# Altium schematic sheet Sheet1.SchDoc
size A4; SheetNumber: 1; SheetTotal: 1; SPICEModelCacheRXAKOMBT: <root> / <DocumentId>RXAKOMBT</DocumentId> / </root>
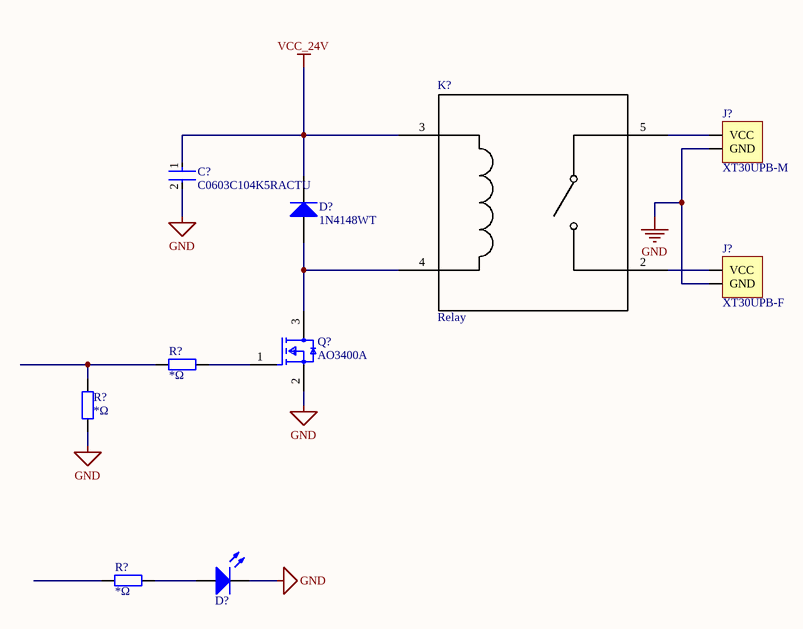
[diagram p0: Sheet1.SchDoc]

## Parts
(Parts that share a designator on the sheet are numbered #1, #2 ... from top to bottom, then left to right.)
C?  C0603C104K5RACTU  [FP-C0603C-CF-MFG]
D?#1  1N4148WT  [FAIR-SOD-523F-2_V]
D?#2  LED  [LED_0603_B]  (value not drawn)
J?#1  XT30UPB-M  [XT30UPB-M]
J?#2  XT30UPB-F  [XT30UPB-F]
K?  Relay  [RELAY-TH_HF105F-XXX-1HXXX-XXX]
Q?  AO3400A  [FP-SOT23-MFG]
R?#1  *Ω  [0603_R]
R?#2  *Ω  [0603_R]
R?#3  *Ω  [0603_R]

## Nets
GND: C?.2 D?#2.2(K) J?#1.2(GND) J?#2.2(GND) Q?.2(S) R?#2.1
VCC_24V: C?.1 D?#1.1(K) K?.3
NetD?#1_2: D?#1.2(A) K?.4 Q?.3(D)
NetD?#2_1: D?#2.1(A) R?#3.2
NetJ?#1_1: J?#1.1(VCC) K?.5
NetJ?#2_1: J?#2.1(VCC) K?.2
NetQ?_1: Q?.1(G) R?#1.2
NetR?#1_1: R?#1.1 R?#2.2

Not connected (* = marked no-connect by the designer): R?#3 1

## Library data of the parts
C? = CMP-2006-03061-2: CAP CER 0.1UF 50V X7R 0603; Manufacturer: KEMET; Tolerance: 0.1; Temperature Coefficient: 30ppm/°C; Material: Ceramic; Automotive Grade: Grade 1; Value: 0.10 μF; Temperature: -55°C to +125°C; RoHS: TRUE; Temperature Range High: +125°C; Lead Free: Yes; Octopart: https://octopart.com/c0603c104k5ractu-kemet-139244; Digikey Description: CAP CER 0.1UF 50V X7R 0603; Category: Cap; Package: C0603C-CF; ComponentLink2Description: Datasheet; Temperature Range Low: -55°C; Device Class L1: Passive Components; Voltage Rating: 50 V; Automotive: Yes; Device Class L3: Ceramic Capacitors; ComponentLink2URL: https://api.kemet.com/component-edge/download/datasheet/C0603C100J5GACAUTO.pdf; Capacitance: 0.10 μF; Device Class L2: Capacitors; Manufacturer Part Number: C0603C104K5RACTU; Temperature Characteristic: X7R; Height: 0.87mm
D?#1 = CMP-0881-00001-1: High Conductance Fast Switching Diode, 75 V, -55 to 150 degC, 2-Pin SOD523F, RoHS; Manufacturer: Fairchild Semiconductor; IR (VR: 75 V)=5 uA Max.; VF: 1 V Max.; BVR (IR: 5 uA)=75 V Min.; CO: 4 pF Max.; DatasheetVersion: Rev. A2; ComponentLink1Description: Manufacturer URL; PackageDescription: 2-Pin Surface Mount Device, Body 1.2 x 0.8 mm, Height 0.7 mm; ComponentLink2URL: http://www.fairchildsemi.com/ds/1N/1N4148WT.pdf; ComponentLink2Description: Datasheet; PartNumber: 1N4148WT; ComponentLink1URL: http://www.fairchildsemi.com/; Temperature Range: -55 to 150 degC; Mounting Technology: Surface Mount; PackageReference: SOD-523F-2; RoHS: TRUE
D?#2 = LED: Value: 0603-RED; Published: 8-Jun-2000; LatestRevisionDate: 08-Jul-2005; LatestRevisionNote: Mech Layer 1 removed.; PackageReference: 0603; Publisher: JonesLee; PackageDescription: LED; 2 Leads; Package: 0603
J?#1 = XT30UPB-M: XT30 PCB立式公头
J?#2 = XT30UPB-F: XT30 PCB立式母头
K? = HF105F-1: Power Relay
Q? = CMP-83955-000006-1: MOSFET N-CH 30V 5.7A SOT23; Input Capacitance: 630pF; Number of Elements: 1; Rds On Max: 26.5mR; Max Power Dissipation: 1.4W; Gate to Source Voltage (Vgs): 12V; Min Operating Temperature: -55°C; Lead Free: Lead Free; Number of Pins: 3; Drain to Source Voltage (Vdss): 30V; Case/Package: SOT-23; Mount: Surface Mount; Continuous Drain Current (ID): 5.7A; Radiation Hardening: No; Packaging: Tape and Reel; Max Operating Temperature: 150°C; Power Dissipation: 1.4W
R?#1-R?#3 = 0603 Res: 贴片电阻